# EAGLE design THAT15xx_DSheet (EAGLE 9.6.2)
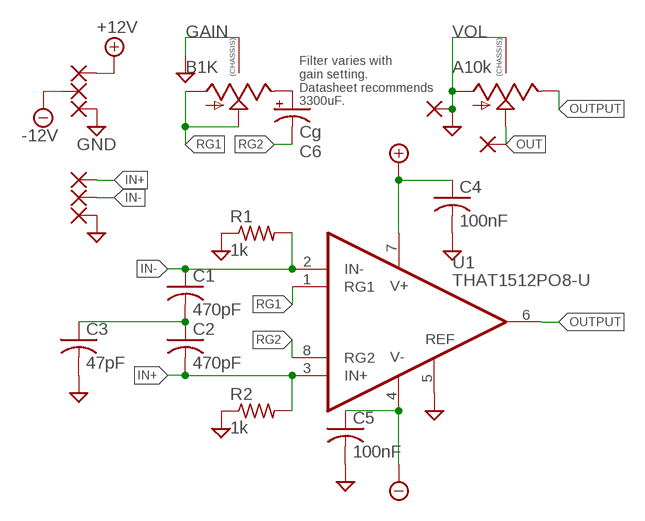
[diagram p0: schematic, sheet 1]

## Parts
C1  470pF  C-USC0805  [C0805]
C2  470pF  C-USC0805  [C0805]
C3  47pF  C-USC0805  [C0805]
C4  100nF  C-USC0805  [C0805]
C5  100nF  C-USC0805  [C0805]
C6  Cg  CAP_SMD+THRUPAN_C  [PAN_C_SMD+THRU]
GAIN  B1K  9MM_SNAP-IN_POT_CHASSIS  [9MM_SNAP-IN_POT]
PAD1  WIREPAD1,6/0,9  [1,6/0,9]
PAD2  WIREPAD1,6/0,9  [1,6/0,9]
PAD3  WIREPAD1,6/0,9  [1,6/0,9]
PAD4  WIREPAD1,6/0,9  [1,6/0,9]
PAD5  WIREPAD1,6/0,9  [1,6/0,9]
PAD6  WIREPAD1,6/0,9  [1,6/0,9]
PAD7  WIREPAD1,6/0,9  [1,6/0,9]
PAD8  WIREPAD1,6/0,9  [1,6/0,9]
R1  1k  R-US_R0805  [R0805]
R2  1k  R-US_R0805  [R0805]
U1  THAT1512PO8-U  [DIL08]
VOL  A10k  9MM_SNAP-IN_POT_CHASSIS  [9MM_SNAP-IN_POT]

## Nets
+12V: C4.1 PAD3.1(P) U1.7(V+)
-12V: C5.1 PAD1.1(P) U1.4(V-)
GND: C3.2 C4.2 C5.2 GAIN.CHASSIS1 GAIN.CHASSIS2 PAD2.1(P) PAD6.1(P) PAD7.1(P) R1.1 R2.1 U1.5(REF) VOL.1(A) VOL.CHASSIS1 VOL.CHASSIS2
IN+: C2.2 PAD4.1(P) R2.2 U1.3(IN+)
IN-: C1.1 PAD5.1(P) R1.2 U1.2(IN-)
N$1: C1.2 C2.1 C3.1
N$5: C6.+ C6.++(+) GAIN.3(E)
OUT: PAD8.1(P) VOL.2(S)
OUTPUT: U1.6(OUT) VOL.3(E)
RG1: GAIN.1(A) GAIN.2(S) U1.1(RG1)
RG2: C6.- C6.--(-) U1.8(RG2)

## Notes on the sheet
- Filter varies with
  gain setting.
  Datasheet recommends
  3300uF.

## Library data of the parts
C1-C5 = resistor:C-US: CAPACITOR, American symbol
C6 = MusicThingModular:CAP_SMD+THRU
GAIN VOL = MusicThingModular:9MM_SNAP-IN_POT_CHASSIS: 9mm vertical snap-in pot, Alpha / Panasonic style, with a connection to the metal chassis for grounding
PAD1-PAD8 = wirepad:WIREPAD: Wire PAD connect wire on PCB
R1 R2 = resistor:R-US_: RESISTOR, American symbol
U1 = that-corp:THAT1512: Audio Preamplifier IC, Low Noise, High Performance

## Board
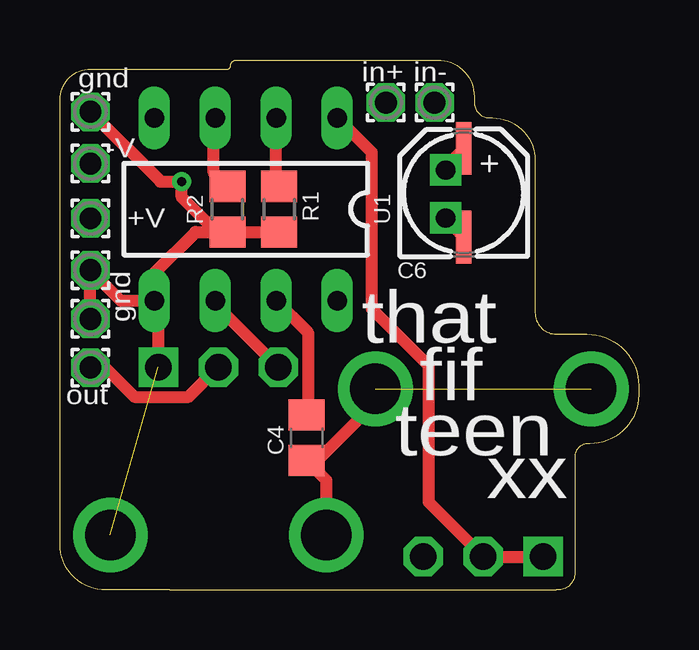
[diagram p1: board, top side]
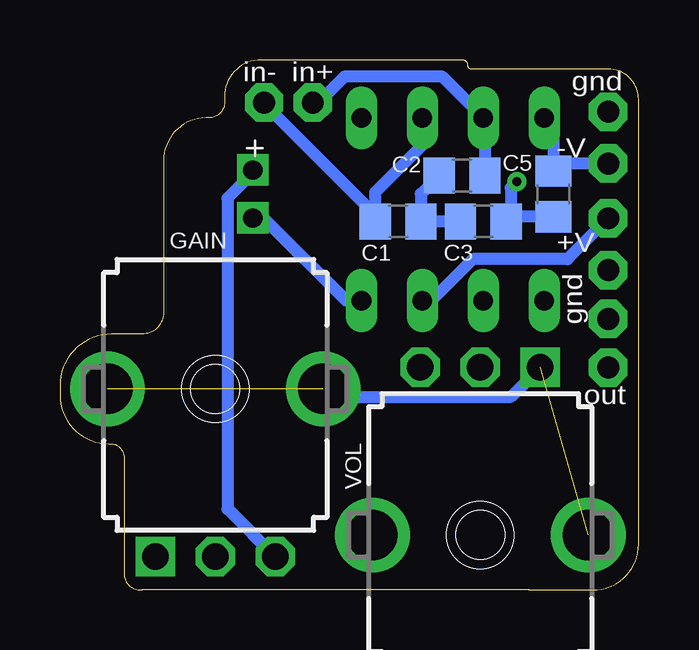
[diagram p2: board, bottom side, seen from below]

Size 24.13 x 22.1 mm. Coordinates in mm from the lower left corner, seen from the top.
Outline: 4.57,0 20.7,0 arc90 21.46,0.64 21.46,5.46 arc-90 21.97,6.1 22.1,6.1 arc90 24.13,8.13 24.13,8.51 arc90 21.97,10.67 20.7,10.67 arc-90 19.81,11.56 19.81,17.91 arc90 18.03,19.69 17.91,19.69 arc-90 17.27,20.32 17.27,20.58 arc90 15.75,22.1 7.37,22.1 arc90 7.11,21.85 arc-90 6.99,21.72 1.27,21.72 arc90 0,20.45 0,1.91 arc90 1.91,0 4.57,0
Copper layers (1*16): Top 0.035mm / dielectric 1.5mm / Bottom 0.035mm
Design rules "default *": minimum track width 6mil, minimum drill 0.35mm, track to track 6mil, track to pad 6mil, pad to pad 6mil, via to via 6mil, smd to smd 6mil, copper to edge 15mil, drill to drill 6mil, minimum pad ring 10mil, minimum via ring 8mil, stop-mask expansion 4mil, vias tented up to drill 0mil, thermal gap 10mil

### Footprints (pad centres in the part's own frame; a part is rotated, then mirrored left to right if it is on the bottom)
C0805 = smd 1.3 x 1.5: 1 -0.95,0; 2 0.95,0
PAN_C_SMD+THRU = smd 2.2 x 0.65: + 1.9,-0.2; - -1.8,-0.2 | drill 0.8 pad 0.9 square: ++ 1,0.55; -- -1,0.55
9MM_SNAP-IN_POT = drill 1.1 square: 1 -2.5,-7 | drill 1.1 octagon: 2 0,-7; 3 2.5,-7 | drill 2.1 pad 2.794: CHASSIS1 -4.5,0; CHASSIS2 4.5,0
1,6/0,9 = drill 0.914 pad 1.6 octagon: 1 0,0
R0805 = smd 1.3 x 1.5: 1 -0.95,0; 2 0.95,0
DIL08 = drill 0.813 long: 1 -3.81,-3.81; 2 -1.27,-3.81; 3 1.27,-3.81; 4 3.81,-3.81; 5 3.81,3.81; 6 1.27,3.81; 7 -1.27,3.81; 8 -3.81,3.81

### Placement (x,y rotation side)
C1  10.03,15.37 0 bottom
C2  7.37,17.27 0 bottom
C3  6.48,15.37 0 bottom
C4  10.29,6.35 270 top
C5  3.56,16.51 270 bottom
C6  16.64,16.51 90 top
GAIN  17.65,8.38 0 bottom
PAD1  1.27,17.78 0 top
PAD2  1.27,11.31 0 top
PAD3  1.27,15.5 0 top
PAD4  13.59,20.32 0 top
PAD5  15.62,20.32 0 top
PAD6  1.27,19.94 0 top
PAD7  1.27,13.34 0 top
PAD8  1.27,9.27 0 top
R1  9.14,15.88 90 top
R2  6.99,15.88 90 top
U1  7.75,15.88 180 top
VOL  6.6,2.29 180 bottom

### Tracks (layer width: path | path; a pad name or v marks a point on that pad's centre or on a via)
+12V
  Top 0.508: C4.1 10.34,7.35 10.34,10.75 U1.7
  Bottom 0.508: PAD3.1 2.97,13.79 6.92,13.79 8.65,12.07 U1.7
-12V
  Bottom 0.508: U1.4 3.56,19.31 C5.1 3.24,17.78 PAD1.1
GND  (via drill 0.38)  (2 unrouted)
  Top 0.508: PAD2.1 PAD7.1 2.54,12.07 U1.5 | U1.5 4.1,11.9 VOL.1 | U1.5 4.12,12.07 | R2.1 R1.1 | R2.1 6.53,14.93 5.08,16.38 v5.08,17.02 4.19,17.02 PAD6.1 | VOL.CHASSIS2 11.1,4.59 C4.2 10.74,5.4 13.15,7.81 GAIN.CHASSIS2 | U1.5 3.94,13.21 5.65,14.93 R2.1
  Bottom 0.508: C5.2 5.33,15.56 | 5.33,15.56 C3.2 | v5.08,17.02 5.33,16.77 5.33,15.56 | GAIN.CHASSIS2 12.83,8.06 5.33,8.06 VOL.1
IN+
  Top 0.508: U1.3 6.41,19.62 6.41,17.4 R2.2
  Bottom 0.508: C2.2 6.42,19.63 U1.3 8.2,21.41 12.25,21.41 13.35,20.32 PAD4.1
IN-
  Top 0.508: R1.2 9.02,16.95 U1.2
  Bottom 0.508: PAD5.1 15.62,20.27 10.98,15.63 C1.1 10.98,16.58 9.02,18.55 U1.2
N$1
  Bottom 0.508: C3.1 C1.2 9.08,16.51 C2.1
N$5
  Top 0.508: C6.++ 16.09,17.66 C6.+
  Bottom 0.508: C6.++ 16.09,17.4 17.15,16.33 17.15,3.38 GAIN.3
OUT
  Top 0.508: PAD8.1 1.89,9.27 3.11,8.06 5.37,8.06 VOL.2
OUTPUT
  Top 0.508: VOL.3 6.48,11.92 U1.6
RG1
  Top 0.508: GAIN.1 GAIN.2 15.37,3.67 15.37,9.36 12.99,11.73 12.99,18.25 U1.1
RG2
  Top 0.508: C6.- 16.09,15.46 C6.--
  Bottom 0.508: U1.8 12.19,12.07 15.64,15.51 C6.--

### Text on the board
tPlace: gnd | in+ | in- | -V | +V | gnd | that | out | fif | teen | xx
bPlace: gnd | in+ | in- | -V | +V | gnd | out